# Altium schematic sheet Schematic11_P1.schdoc
size 431 x 309 mm; Symbol: Sheet-Symbol_A4; Device: Sheet-Symbol_A4; Company: EasyEDA.com; Drawed: EasyEDA Pro; Reviewed: EasyEDA Pro; Version: V0.1; Page Size: A4; @Project Name: Madhawa; @Page Count: 1; @Update Date: 2023-12-12; @Create Date: 2023-12-12; @Schematic Name: Schematic1; Part Number: JLCPCB-002; @Page No: 1; @Page Name: P1
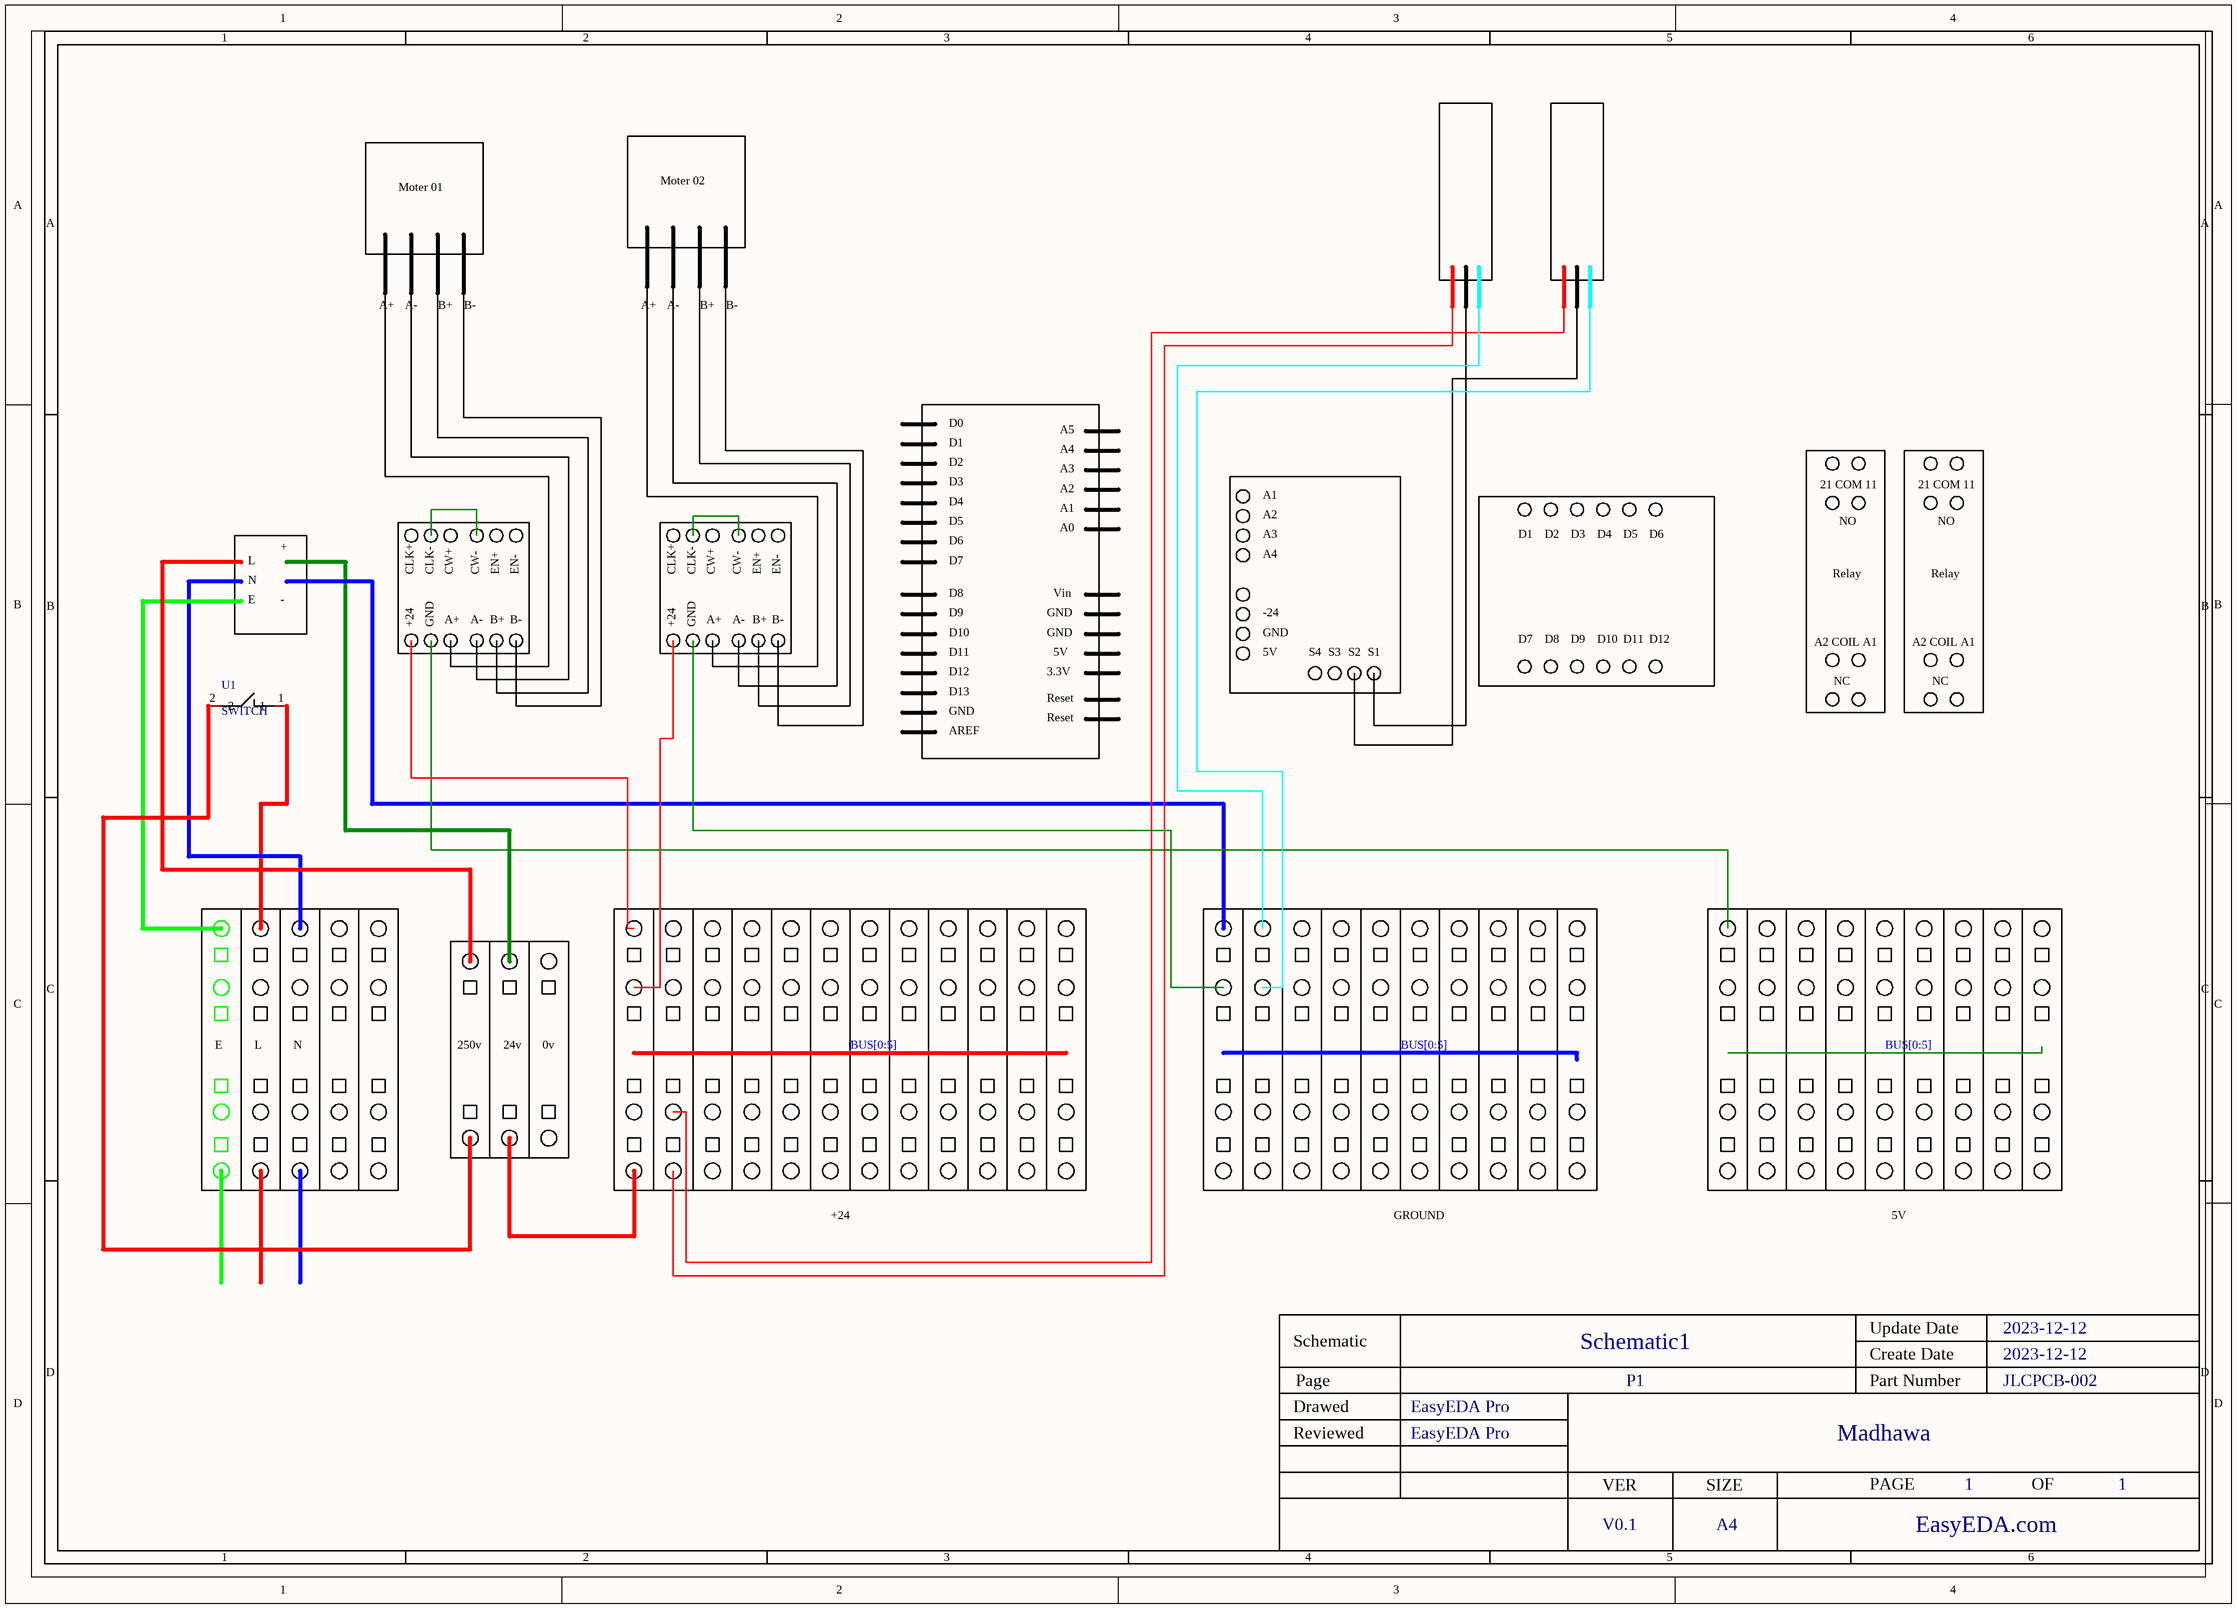
[diagram p0: Schematic11_P1.schdoc]

## Parts
U1  SWITCH  [SW-SMD_L11.5-W2.3-LS15.5]

## Nets

Not connected (* = marked no-connect by the designer): U1 1 2

## Buses and harness runs
bus BUS[0:5]

## Notes on the sheet
- Moter 01
- Moter 02
- A+
- A-
- B+
- B-
- D0
- D1
- A4
- A5
- D2
- D3
- D4
- A1
- A2
- A3
- 21 COM 11
- L
- N
- +
- CLK+
- CLK-
- CW+
- CW-
- EN+
- EN-
- D5
- D6
- D7
- A0
- Relay
- NO
- E
- -
- +24
- GND
- D8
- D9
- D10
- Vin
- -24
- D11
- D12
- A2 COIL A1
- D13
- 3.3V
- Reset
- 5V
- S4
- S3
- S2
- S1
- NC
- AREF
- 250v
- 24v
- 0v
- GROUND
- 1
- 2
- 3
- 4
- 5
- 6
- A
- B
- C
- D
- Schematic
- Schematic1
- Create Date
- Update Date
- 2023-12-12
- Reviewed
- Drawed
- Page
- EasyEDA Pro
- P1
- Part Number
- Madhawa
- JLCPCB-002
- VER
- SIZE
- PAGE
- OF
- V0.1
- EasyEDA.com

## Library data of the parts
U1 = SWITCH: Add into BOM: yes; Name: SWITCH; Symbol: SWITCH; Device: SWITCH; LCSC Part Name: SWITCH; Supplier Part: C9900011059; Manufacturer Part: SWITCH; Supplier Footprint: SW-SMD; Supplier: LCSC; Convert to PCB: yes